# Altium project Minion_1_SiC780A_Rev01.PrjPCB (part 1 of 3)
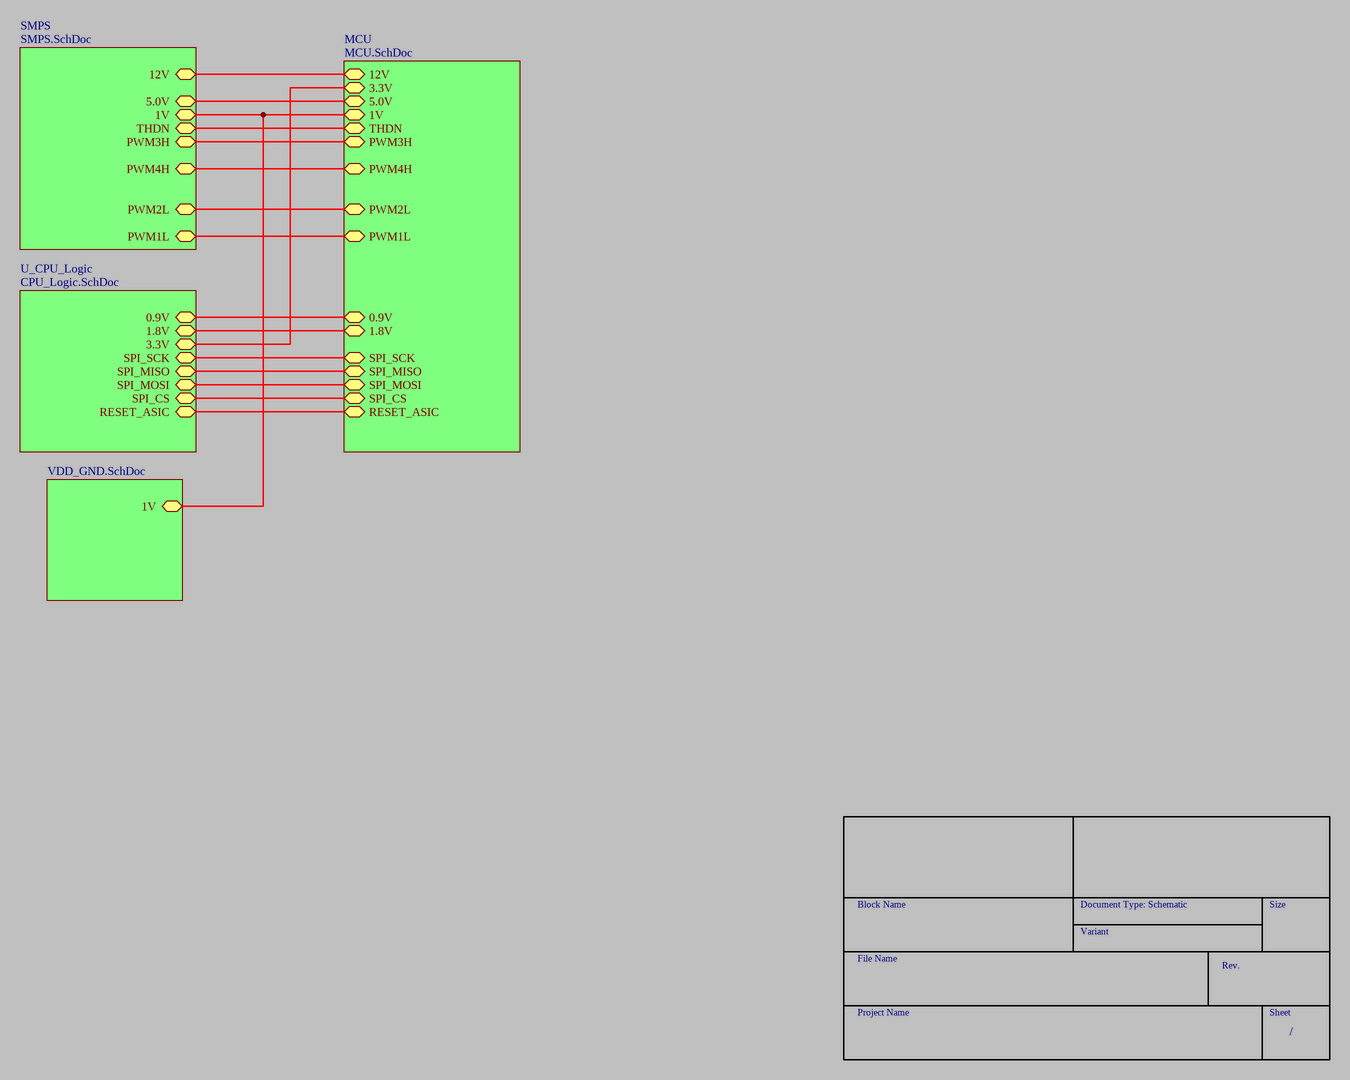
[diagram p0: Block.SchDoc]
5 sheets, 410 parts. Net scope: hierarchical (ports join the sheet entries above them; power ports are global).
Board file: Minion_1_SiC780A_Rev01.PcbDoc
Sheets:
  Block.SchDoc
    U_CPU_Logic = CPU_Logic.SchDoc
    MCU = MCU.SchDoc
    SMPS = SMPS.SchDoc
    VDD_GND = VDD_GND.SchDoc

## Sheet Block.SchDoc: Title
size A3; Date: Date; CompanyName: Integrated Micro-Electronics Bulgaria; Organization: Design & Development Department; Address1: Drawing Type; Address2: Address 1; Address3: Address 2; Address4: Address 3; DocumentNumber: 730xxx; Revision: 01; SheetNumber: 1; SheetTotal: 1; PageSetup: Record=PageOptions|CenterHorizontal=True|CenterVertical=True|PrintScale=0.70|XCorrection=1.00|YCorrection=1.00|PrintKind=2|BorderSize=5000000|LeftOffset=0|BottomOffset=0|Orientation=2|PaperLength=1000|PaperWidth=1000|Scale=100|PaperSource=7|PrintQuality=-4|MediaType=1|DitherType=10|PaperKind=11" x 17"|PrintScaleMode=1; SheetSize: A3; Time: Time; ModifiedDate: Mod. Date

### Sub-sheets
MCU = MCU.SchDoc: 1V, 12V, 3.3V, 5.0V, PWM3H, PWM4H, PWM2L, PWM1L, 1.8V, 0.9V, RESET_ASIC, SPI_CS, SPI_SCK, SPI_MISO, SPI_MOSI, THDN
SMPS = SMPS.SchDoc: 1V, 12V, 5.0V, PWM3H, PWM4H, PWM2L, PWM1L, THDN
U_CPU_Logic = CPU_Logic.SchDoc: 1.8V, 0.9V, SPI_SCK, SPI_CS, SPI_MOSI, SPI_MISO, RESET_ASIC, 3.3V
VDD_GND = VDD_GND.SchDoc: 1V

### Nets
0.9V: sheet U_CPU_Logic/0.9V, sheet MCU/0.9V
1.8V: sheet U_CPU_Logic/1.8V, sheet MCU/1.8V
1V: sheet MCU/1V, sheet SMPS/1V, sheet VDD_GND/1V
3.3V: sheet U_CPU_Logic/3.3V, sheet MCU/3.3V
5.0V: sheet MCU/5.0V, sheet SMPS/5.0V
12V: sheet MCU/12V, sheet SMPS/12V
PWM1L: sheet MCU/PWM1L, sheet SMPS/PWM1L
PWM2L: sheet MCU/PWM2L, sheet SMPS/PWM2L
PWM3H: sheet MCU/PWM3H, sheet SMPS/PWM3H
PWM4H: sheet MCU/PWM4H, sheet SMPS/PWM4H
RESET_ASIC: sheet U_CPU_Logic/RESET_ASIC, sheet MCU/RESET_ASIC
SPI_CS: sheet U_CPU_Logic/SPI_CS, sheet MCU/SPI_CS
SPI_MISO: sheet U_CPU_Logic/SPI_MISO, sheet MCU/SPI_MISO
SPI_MOSI: sheet U_CPU_Logic/SPI_MOSI, sheet MCU/SPI_MOSI
SPI_SCK: sheet U_CPU_Logic/SPI_SCK, sheet MCU/SPI_SCK
THDN: sheet MCU/THDN, sheet SMPS/THDN

### Notes on the sheet
- Block Name
- Document Type: Schematic
- Size
- File Name
- Variant
- Rev.
- Project Name
- Sheet
- /

## Sheet CPU_Logic.SchDoc: Title
size A1; Date: Date; CompanyName: Integrated Micro-Electronics Bulgaria; Organization: Design & Development Department; Address1: Drawing Type; Address2: Address 1; Address3: Address 2; Address4: Address 3; DocumentNumber: 730xxx; Revision: 01; SheetNumber: 1; SheetTotal: 1; PageSetup: Record=PageOptions|CenterHorizontal=True|CenterVertical=True|PrintScale=0.70|XCorrection=1.00|YCorrection=1.00|PrintKind=2|BorderSize=5000000|LeftOffset=0|BottomOffset=0|Orientation=2|PaperLength=1000|PaperWidth=1000|Scale=100|PaperSource=7|PrintQuality=-4|MediaType=1|DitherType=10|PaperKind=A4|PrintScaleMode=1; SheetSize: A3; Time: Time; ModifiedDate: Mod. Date
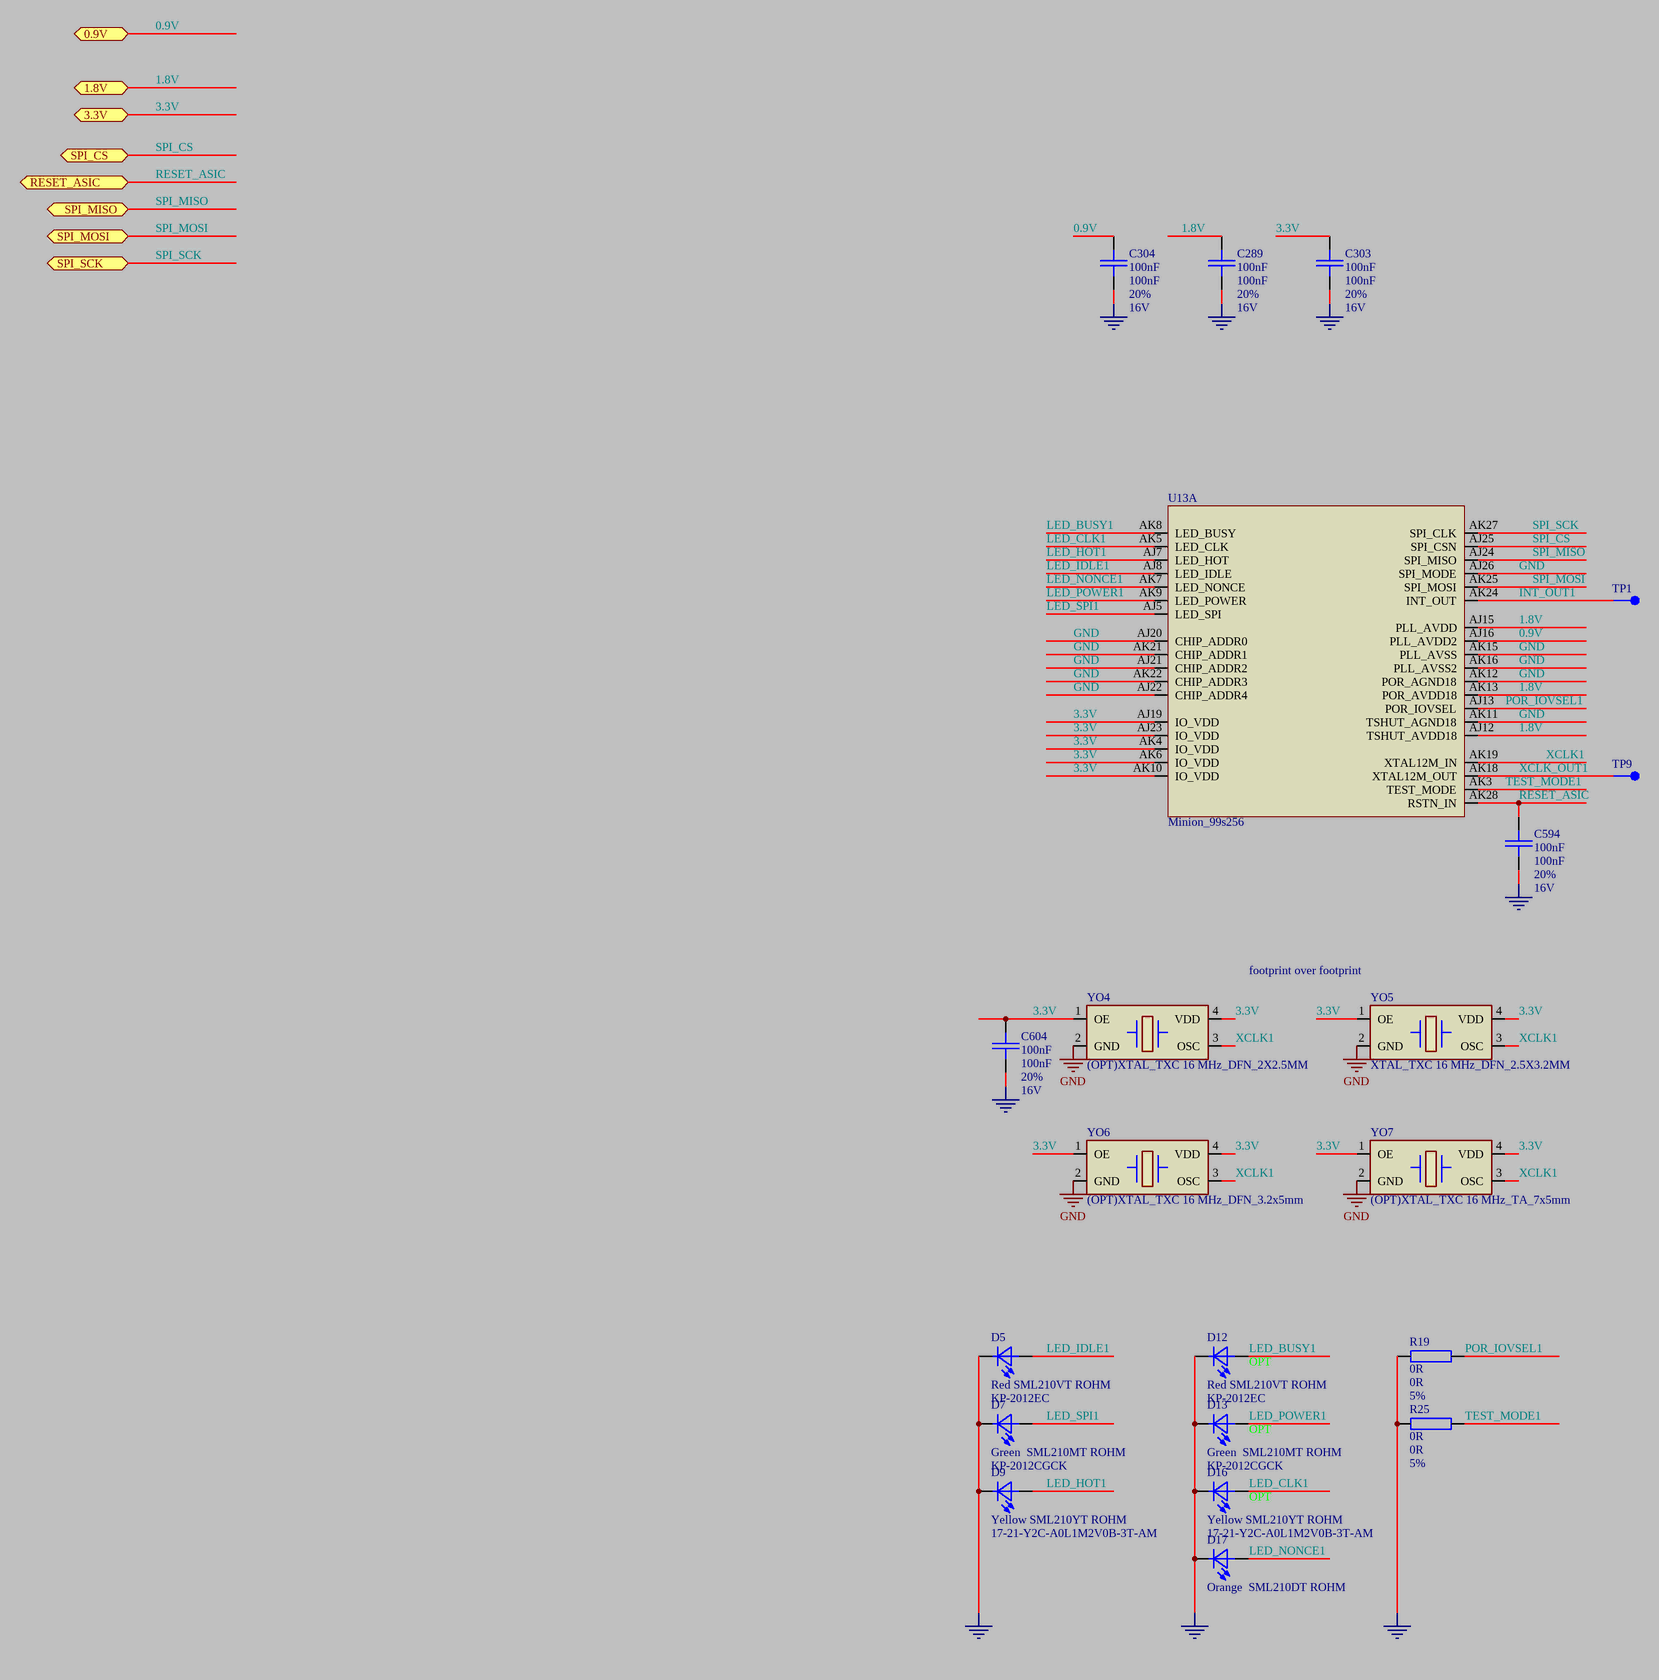
[diagram p1: CPU_Logic.SchDoc]

### Parts
C289  100nF  DB_TOLERANCE: 20%  DB_VOLTAGE: 16V  [SMD_0603_CAPC1608X95N]
C303  100nF  DB_TOLERANCE: 20%  DB_VOLTAGE: 16V  [SMD_0603_CAPC1608X95N]
C304  100nF  DB_TOLERANCE: 20%  DB_VOLTAGE: 16V  [SMD_0603_CAPC1608X95N]
C594  100nF  DB_TOLERANCE: 20%  DB_VOLTAGE: 16V  [SMD_0603_CAPC1608X95N]
C604  100nF  DB_TOLERANCE: 20%  DB_VOLTAGE: 16V  [SMD_0603_CAPC1608X95N]
D5  Red SML210VT ROHM  DB_VALUE: KP-2012EC  [SMD_0805_LED2012X100N]
D7  Green  SML210MT ROHM  DB_VALUE: KP-2012CGCK  [SMD_0805_LED2012X100N]
D9  Yellow SML210YT ROHM  DB_VALUE: 17-21-Y2C-A0L1M2V0B-3T-AM  [SMD_0805_LED2012X100N]
D12  Red SML210VT ROHM  DB_VALUE: KP-2012EC  [SMD_0805_LED2012X100N]
D13  Green  SML210MT ROHM  DB_VALUE: KP-2012CGCK  [SMD_0805_LED2012X100N]
D16  Yellow SML210YT ROHM  DB_VALUE: 17-21-Y2C-A0L1M2V0B-3T-AM  [SMD_0805_LED2012X100N]
D17  Orange  SML210DT ROHM  [SMD_0805_LED2012X100N]
R19  0R  DB_TOLERANCE: 5%  [SMD_0603_RESC1608X55N]
R25  0R  DB_TOLERANCE: 5%  [SMD_0603_RESC1608X55N]
TP1  TEST_POINT_1  [SMD_TP_100-254]  (value not drawn)
TP9  TEST_POINT_1  [SMD_TP_100-254]  (value not drawn)
U13  Minion_99s256  [SMD_BGA900C80P30X30]  (part A of 3)
YO4  (OPT)XTAL_TXC 16 MHz_DFN_2X2.5MM  [SMD_OSCCF200X250X90-4N]
YO5  XTAL_TXC 16 MHz_DFN_2.5X3.2MM  [SMD_OSCCF250X320X90-4N]
YO6  (OPT)XTAL_TXC 16 MHz_DFN_3.2x5mm  [SMD_OSCCF320X400X90-4N]
YO7  (OPT)XTAL_TXC 16 MHz_TA_7x5mm  [SMD_OSCCC500X700X100-4N]

### Ports
0.9V, 1.8V, 3.3V, RESET_ASIC, SPI_CS, SPI_MISO, SPI_MOSI, SPI_SCK

### Nets
GND: C289.1 C303.1 C304.1 C594.2 C604.2 D5.1(C) D7.1(C) D9.1(C) D12.1(C) D13.1(C) D16.1(C) D17.1(C) R19.1 R25.1 U13.AJ20(CHIP_ADDR0) U13.AJ21(CHIP_ADDR2) U13.AJ22(CHIP_ADDR4) U13.AJ26(SPI_MODE) U13.AK11(TSHUT_AGND18) U13.AK12(POR_AGND18) U13.AK15(PLL_AVSS) U13.AK16(PLL_AVSS2) U13.AK21(CHIP_ADDR1) U13.AK22(CHIP_ADDR3) YO4.2(GND) YO5.2(GND) YO6.2(GND) YO7.2(GND)
0.9V: C304.2 U13.AJ16(PLL_AVDD2) ; port 0.9V
1.8V: C289.2 U13.AJ12(TSHUT_AVDD18) U13.AJ15(PLL_AVDD) U13.AK13(POR_AVDD18) ; port 1.8V
3.3V: C303.2 C604.1 U13.AJ19(IO_VDD) U13.AJ23(IO_VDD) U13.AK4(IO_VDD) U13.AK6(IO_VDD) U13.AK10(IO_VDD) YO4.1(OE) YO4.4(VDD) YO5.1(OE) YO5.4(VDD) YO6.1(OE) YO6.4(VDD) YO7.1(OE) YO7.4(VDD) ; port 3.3V
INT_OUT1: TP1.1 U13.AK24(INT_OUT)
LED_BUSY1: D12.2(A) U13.AK8(LED_BUSY)
LED_CLK1: D16.2(A) U13.AK5(LED_CLK)
LED_HOT1: D9.2(A) U13.AJ7(LED_HOT)
LED_IDLE1: D5.2(A) U13.AJ8(LED_IDLE)
LED_NONCE1: D17.2(A) U13.AK7(LED_NONCE)
LED_POWER1: D13.2(A) U13.AK9(LED_POWER)
LED_SPI1: D7.2(A) U13.AJ5(LED_SPI)
POR_IOVSEL1: R19.2 U13.AJ13(POR_IOVSEL)
RESET_ASIC: C594.1 U13.AK28(RSTN_IN) ; port RESET_ASIC
SPI_CS: U13.AJ25(SPI_CSN) ; port SPI_CS
SPI_MISO: U13.AJ24(SPI_MISO) ; port SPI_MISO
SPI_MOSI: U13.AK25(SPI_MOSI) ; port SPI_MOSI
SPI_SCK: U13.AK27(SPI_CLK) ; port SPI_SCK
TEST_MODE1: R25.2 U13.AK3(TEST_MODE)
XCLK1: U13.AK19(XTAL12M_IN) YO4.3(OSC) YO5.3(OSC) YO6.3(OSC) YO7.3(OSC)
XCLK_OUT1: TP9.1 U13.AK18(XTAL12M_OUT)

### Notes on the sheet
- footprint over footprint
- (near D12) OPT
- (near D13) OPT
- (near D16) OPT

### Library data of the parts
C289 C303 C304 C594 C604 = CAP000027236: DB_PART_TYPE: Ceramic_SMD\Standard_X7R; DB_MANUFACTURER_PART: KEMET    C0603C104M4RAC; NOTE: <NOTE>; DB_T_RANGE: -55 to 125; DB_PACKAGE: 0603; DB_DESCRIPTION: C X7R 100nF 20% 16V 0603; DB_CERTIFIED: ISHIDDEN=T; DB_APPROVED_ON: 09.10.2010 г.; DB_STATUS: NEW; DB_PART_NUMBER: CAP000027236; DB_VALUE: 100nF; DB_PCB_DEVICE: SMD_0603_CAPC1608X95N; DB_PRICE: ISHIDDEN=T; DB_LEADTIME: ISHIDDEN=T; DB_MOQ: ISHIDDEN=T; DB_PRICE_DATE: ISHIDDEN=T; DB_APPROVED_BY: ISHIDDEN=T; DB_DATASHEET: http://john.epiqdesign.com/projects/CIS_Datasheets/F3102_CE_Kemet.pdf?rev=92&sc=0
D5 D12 = OPT000000095: DB_MANUFACTURER_PART: KINGBRIGHT       KP-2012EC; NOTE: <NOTE>; DB_T_RANGE: -40 to 85; DB_PACKAGE: 0805; DB_DESCRIPTION: LED RED 0805; DB_CERTIFIED: ISHIDDEN=T; DB_APPROVED_BY: VSN; DB_APPROVED_ON: 08.4.2014 г. 09:20:29; DB_STATUS: NEW; DB_PCB_DEVICE: SMD_0805_LED2012X100N; DB_PART_NUMBER: OPT000000095; DB_PART_TYPE: LED; DB_COLOUR: RED; DB_DATASHEET: http://john.epiqdesign.com/projects/CIS_Datasheets/LED_KP-2012EC_0805_RED.pdf?rev=1358&sc=0
D7 D13 = OPT000000096: DB_MANUFACTURER_PART: KINGBRIGHT       KP-2012CGCK; NOTE: <NOTE>; DB_T_RANGE: -40 to 85; DB_PACKAGE: 0805; DB_DESCRIPTION: LED GREEN 0805; DB_CERTIFIED: ISHIDDEN=T; DB_APPROVED_BY: VSN; DB_APPROVED_ON: 08.4.2014 г. 09:22:12; DB_STATUS: NEW; DB_PCB_DEVICE: SMD_0805_LED2012X100N; DB_PART_NUMBER: OPT000000096; DB_PART_TYPE: LED; DB_COLOUR: GREEN; DB_DATASHEET: http://john.epiqdesign.com/projects/CIS_Datasheets/LED_KP-2012CGCK_0805_GREEN.pdf?rev=1359&sc=0
D9 D16 = OPT000000092: DB_MANUFACTURER_PART: EVERLIGHT       17-21-Y2C-A0L1M2V0B-3T-AM; NOTE: <NOTE>; DB_T_RANGE: -40 to 100; DB_PACKAGE: 0805; DB_DESCRIPTION: LED YELLOW 0805; DB_CERTIFIED: AUT; DB_APPROVED_BY: VSN; DB_APPROVED_ON: 17.6.2013 г. 13:21:58; DB_STATUS: NEW; DB_PCB_DEVICE: SMD_0805_LED2012X100N; DB_PART_NUMBER: OPT000000092; DB_PART_TYPE: LED; DB_COLOUR: YELLOW; DB_DATASHEET: http://john.epiqdesign.com/projects/CIS_Datasheets/LED_17-21-Y2C-A0L1M2V0B-3T-AM.pdf?rev=1220&sc=0
D17 = OPT000000096: DB_PART_TYPE: LED; DB_MANUFACTURER_PART: KINGBRIGHT       KP-2012CGCK; NOTE: <NOTE>; DB_T_RANGE: -40 to 85; DB_COLOUR: GREEN; DB_PACKAGE: 0805; DB_DESCRIPTION: LED GREEN 0805; DB_CERTIFIED: ISHIDDEN=T; DB_APPROVED_BY: VSN; DB_APPROVED_ON: 08.4.2014 г. 09:22:12; DB_STATUS: NEW; DB_VALUE: KP-2012CGCK; DB_PCB_DEVICE: SMD_0805_LED2012X100N; DB_PART_NUMBER: OPT000000096; DB_DATASHEET: http://john.epiqdesign.com/projects/CIS_Datasheets/LED_KP-2012CGCK_0805_GREEN.pdf?rev=1359&sc=0
R19 R25 = RES000006349: DB_PART_TYPE: SMD; DB_MANUFACTURER_PART: YAGEO    RC0603JR-070R; NOTE: <NOTE>; DB_T_RANGE: -55 to 155; DB_POWER: 1/10W; DB_PACKAGE: 0603; DB_DESCRIPTION: R SMD 0R 5% 1/10W 0603; DB_CERTIFIED: ISHIDDEN=T; DB_PRICE: 0.000364; DB_MOQ: 5000; DB_APPROVED_ON: 09.10.2010 г.; DB_STATUS: NEW; R_BDS: R; DB_PART_NUMBER: RES000006349; DB_VALUE: 0R; DB_PCB_DEVICE: SMD_0603_RESC1608X55N; DB_PRICE_DATE: 2010-12-23; DB_APPROVED_BY: ISHIDDEN=T; DB_DATASHEET: http://john.epiqdesign.com/projects/CIS_Datasheets/PYu-RC0603_51_RoHS_L_4_YAGEO.pdf?rev=138&sc=0
TP1 TP9 = TPO000000001: DB_PART_TYPE: Test Point; DB_VALUE: 100_254; DB_PACKAGE: ISHIDDEN=T; DB_DESCRIPTION: Test Point 100_254; DB_APPROVED_ON: 10.9.2010 г.; DB_STATUS: NEW; DB_PART_NUMBER: TPO000000001; DB_DIAMETER: 100_254; DB_PCB_DEVICE: SMD_TP_100-254; DB_MANUFACTURER_PART: ISHIDDEN=T; DB_CERTIFIED: ISHIDDEN=T; DB_PRICE: ISHIDDEN=T; DB_LEADTIME: ISHIDDEN=T; DB_MOQ: ISHIDDEN=T; DB_PRICE_DATE: ISHIDDEN=T; DB_APPROVED_BY: ISHIDDEN=T; DB_DATASHEET: ISHIDDEN=T
YO4 = SMD_OSC_DFN_2X2.5MM: NOTE: <NOTE>; DB_PCB_DEVICE: SMD_OSCCF200X250X90-4N
YO5 = SMD_OSC_DFN_2.5X3.2MM: NOTE: <NOTE>; DB_PCB_DEVICE: SMD_OSCCF250X320X90-4N
YO6 = SMD_OSC_DFN_3.2x5mm: NOTE: <NOTE>; DB_PCB_DEVICE: SMD_OSCCF320X400X90-4N
YO7 = SMD_OSC_TA_7x5mm: NOTE: <NOTE>; DB_PCB_DEVICE: SMD_OSCCC500X700X100-4N
U13 = Minion_99s256: DB_PCB_DEVICE: SMD_BGA900C80P30X30

## Sheet MCU.SchDoc: Title
size A2; Date: Date; CompanyName: Integrated Micro-Electronics Bulgaria; Organization: Design & Development Department; Address1: Drawing Type; Address2: Address 1; Address3: Address 2; Address4: Address 3; DocumentNumber: 730xxx; Revision: 01; SheetNumber: 1; SheetTotal: 1; PageSetup: Record=PageOptions|CenterHorizontal=True|CenterVertical=True|PrintScale=0.70|XCorrection=1.00|YCorrection=1.00|PrintKind=2|BorderSize=5000000|LeftOffset=0|BottomOffset=0|Orientation=2|PaperLength=1000|PaperWidth=1000|Scale=100|PaperSource=7|PrintQuality=-4|MediaType=1|DitherType=10|PaperKind=A4|PrintScaleMode=1; SheetSize: A3; Time: Time; ModifiedDate: Mod. Date
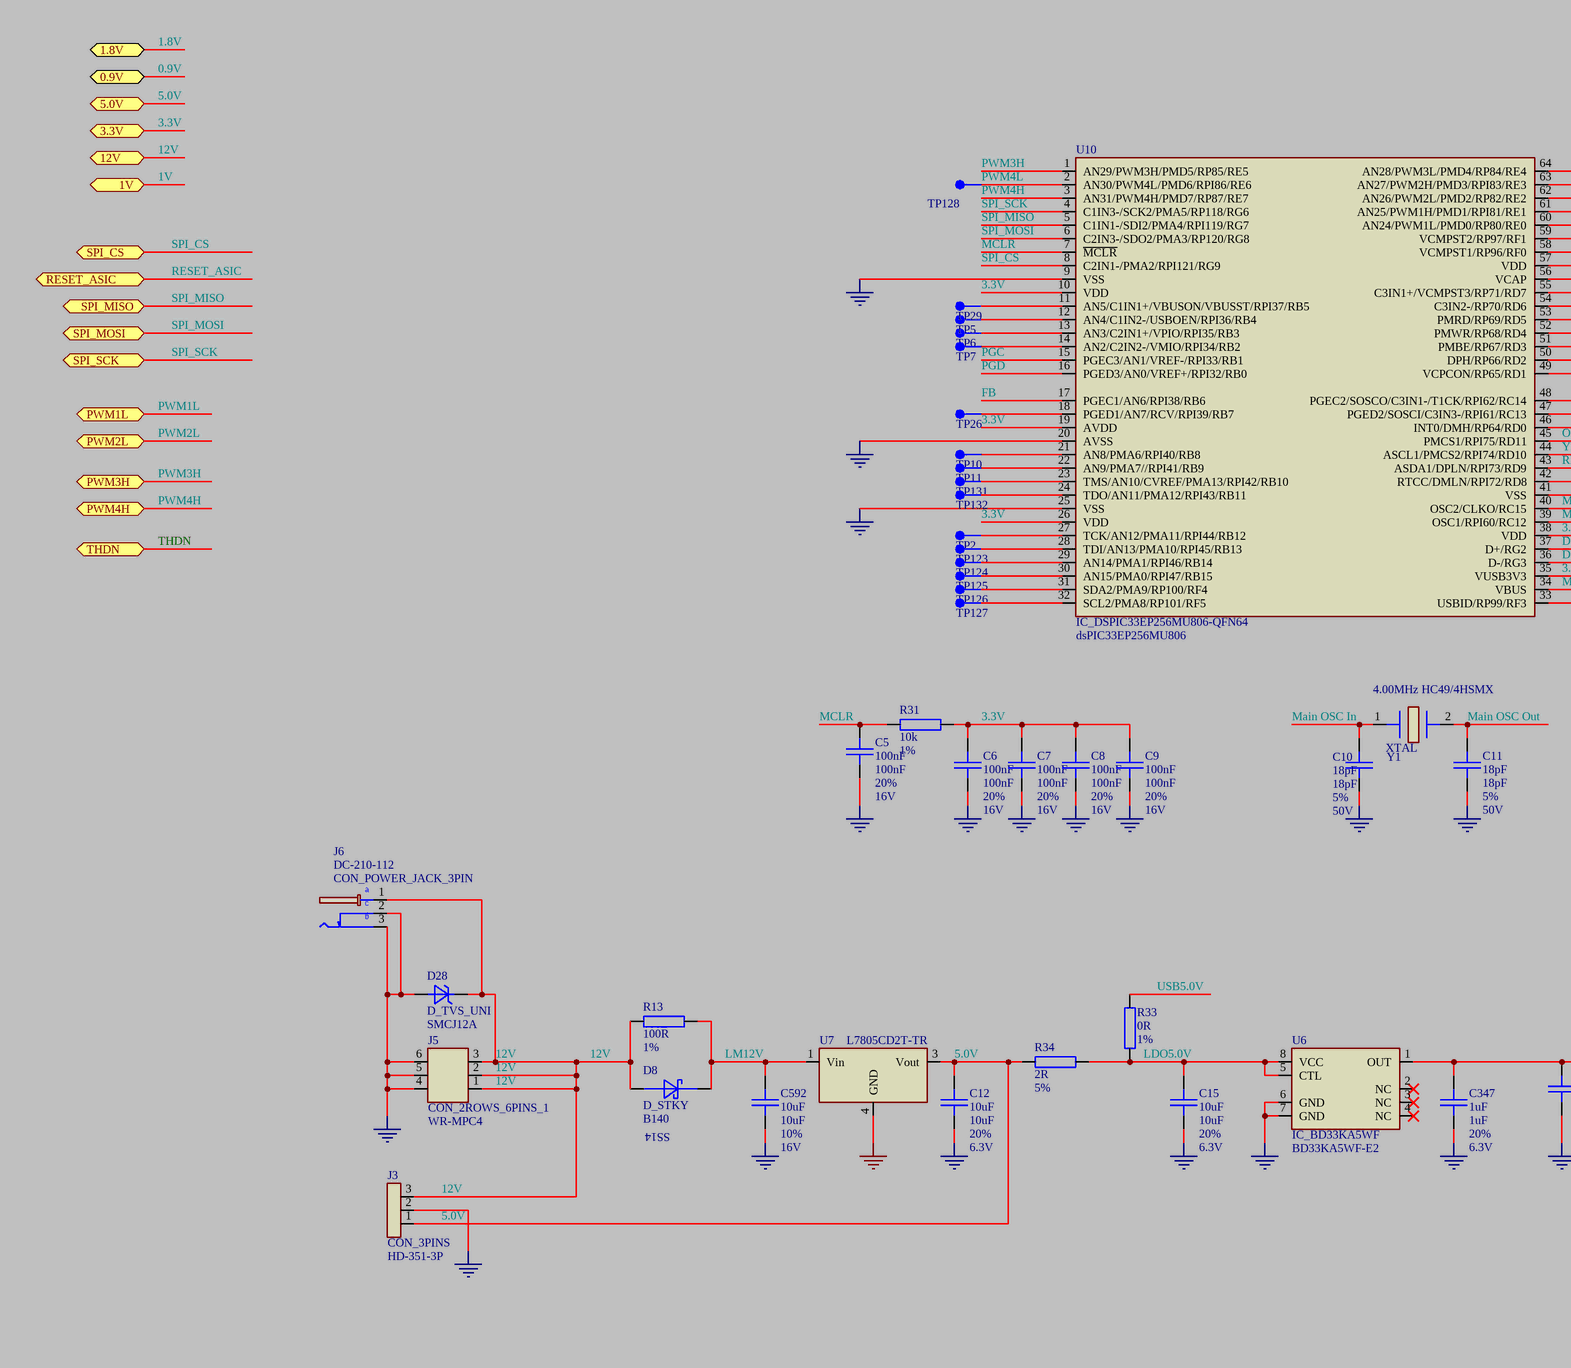
[diagram p2: MCU.SchDoc, left]
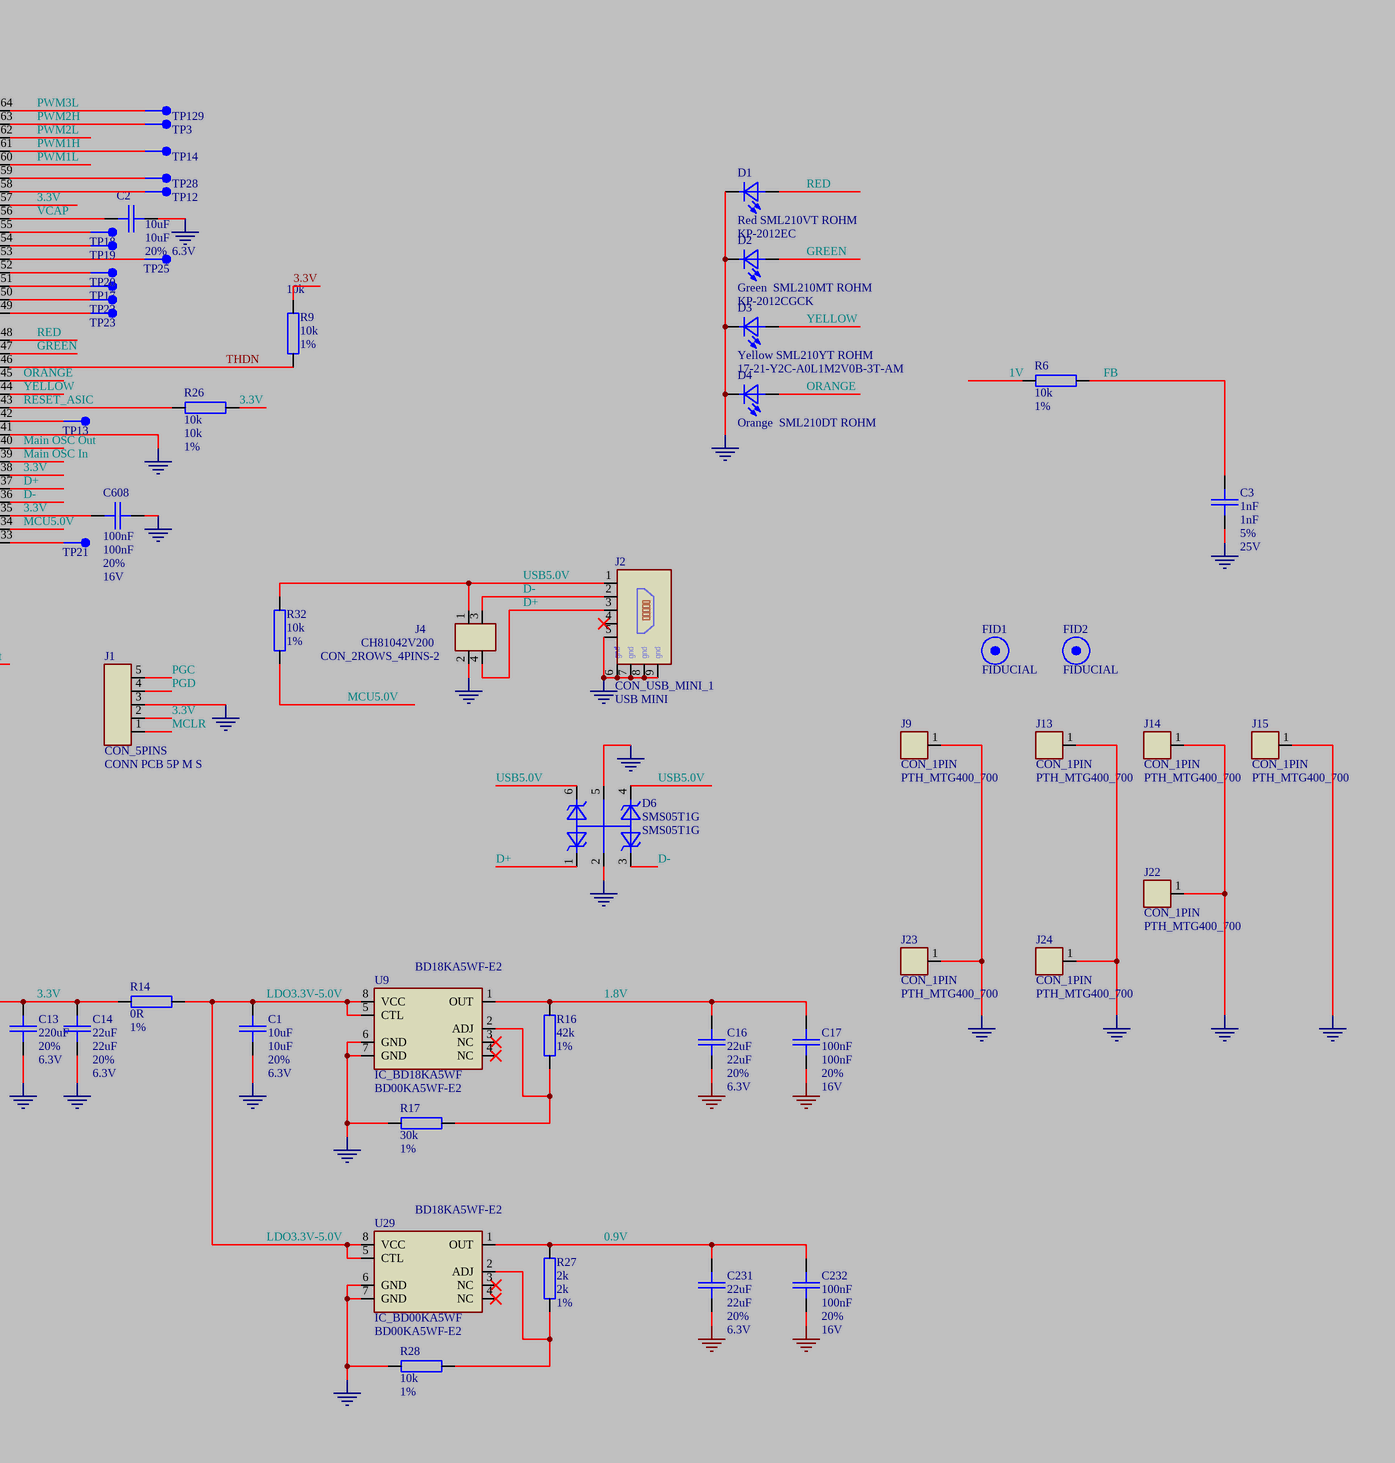
[diagram p3: MCU.SchDoc, right]

### Parts
C1  10uF  DB_TOLERANCE: 20%  DB_VOLTAGE: 6.3V  [SMD_0603_CAPC1608X95N]
C2  10uF  DB_TOLERANCE: 20%  DB_VOLTAGE: 6.3V  [SMD_0603_CAPC1608X95N]
C3  1nF  DB_TOLERANCE: 5%  DB_VOLTAGE: 25V  [SMD_0603_CAPC1608X95N]
C5  100nF  DB_TOLERANCE: 20%  DB_VOLTAGE: 16V  [SMD_0603_CAPC1608X95N]
C6  100nF  DB_TOLERANCE: 20%  DB_VOLTAGE: 16V  [SMD_0603_CAPC1608X95N]
C7  100nF  DB_TOLERANCE: 20%  DB_VOLTAGE: 16V  [SMD_0603_CAPC1608X95N]
C8  100nF  DB_TOLERANCE: 20%  DB_VOLTAGE: 16V  [SMD_0603_CAPC1608X95N]
C9  100nF  DB_TOLERANCE: 20%  DB_VOLTAGE: 16V  [SMD_0603_CAPC1608X95N]
C10  18pF  DB_TOLERANCE: 5%  DB_VOLTAGE: 50V  [SMD_0603_CAPC1608X95N]
C11  18pF  DB_TOLERANCE: 5%  DB_VOLTAGE: 50V  [SMD_0603_CAPC1608X95N]
C12  10uF  DB_TOLERANCE: 20%  DB_VOLTAGE: 6.3V  [SMD_0603_CAPC1608X95N]
C13  DB_TOLERANCE: 20%  DB_VOLTAGE: 6.3V  [SMD_1210_CAPC3225X279N]  (hidden comment: 220uF)
C14  22uF  DB_TOLERANCE: 20%  DB_VOLTAGE: 6.3V  [SMD_0805_CAPC2012X145N]
C15  10uF  DB_TOLERANCE: 20%  DB_VOLTAGE: 6.3V  [SMD_0603_CAPC1608X95N]
C16  22uF  DB_TOLERANCE: 20%  DB_VOLTAGE: 6.3V  [SMD_0805_CAPC2012X145N]
C17  100nF  DB_TOLERANCE: 20%  DB_VOLTAGE: 16V  [SMD_0603_CAPC1608X95N]
C231  22uF  DB_TOLERANCE: 20%  DB_VOLTAGE: 6.3V  [SMD_0805_CAPC2012X145N]
C232  100nF  DB_TOLERANCE: 20%  DB_VOLTAGE: 16V  [SMD_0603_CAPC1608X95N]
C347  1uF  DB_TOLERANCE: 20%  DB_VOLTAGE: 6.3V  [SMD_0603_CAPC1608X95N]
C592  10uF  DB_TOLERANCE: 10%  DB_VOLTAGE: 16V  [SMD_0805_CAPC2012X145N]
C608  100nF  DB_TOLERANCE: 20%  DB_VOLTAGE: 16V  [SMD_0603_CAPC1608X95N]
D1  Red SML210VT ROHM  DB_VALUE: KP-2012EC  [SMD_0805_LED2012X100N]
D2  Green  SML210MT ROHM  DB_VALUE: KP-2012CGCK  [SMD_0805_LED2012X100N]
D3  Yellow SML210YT ROHM  DB_VALUE: 17-21-Y2C-A0L1M2V0B-3T-AM  [SMD_0805_LED2012X100N]
D4  Orange  SML210DT ROHM  [SMD_0805_LED2012X100N]
D6  SMS05T1G  [SMD_SOT457_SOT95P275X110-6N]
D8  D_STKY  DB_VALUE: B140  [SMD_DO214AC_SMA]
D28  D_TVS_UNI  DB_VALUE: SMCJ12A  [SMD_DO214AC_SMC]
FID1  FIDUCIAL  [FID100X200]
FID2  FIDUCIAL  [FID100X200]
J1  CON_5PINS  DB_VALUE: CONN PCB 5P M S  [PTH_HDRV05W64P254_1X05]
J2  CON_USB_MINI_1  DB_VALUE: USB MINI  [SMD_CON-CVILUX-CU04-SCM15B0]
J3  CON_3PINS  DB_VALUE: HD-351-3P  [PTH_CON_HD-351-3P]
J4  CON_2ROWS_4PINS-2  DB_VALUE: CH81042V200  [PTH_HDRV40W6240P254_2X02_M]
J5  CON_2ROWS_6PINS_1  DB_VALUE: WR-MPC4  [PTH_CON_WR-MRC4-6P]
J6  CON_POWER_JACK_3PIN  DB_VALUE: DC-210-112  [PTH_DC-POWER-JACK_210-112]
J9  CON_1PIN  [PTH_MTG400_700]
J13  CON_1PIN  [PTH_MTG400_700]
J14  CON_1PIN  [PTH_MTG400_700]
J15  CON_1PIN  [PTH_MTG400_700]
J22  CON_1PIN  [PTH_MTG400_700]
J23  CON_1PIN  [PTH_MTG400_700]
J24  CON_1PIN  [PTH_MTG400_700]
R6  DB_TOLERANCE: 1%  [SMD_0603_RESC1608X55N]  (hidden comment: 10k)
R9  10k  DB_TOLERANCE: 1%  [SMD_0603_RESC1608X55N]
R13  DB_TOLERANCE: 1%  [SMD_1206_RESC3216X65N]  (hidden comment: 100R)
R14  DB_TOLERANCE: 1%  [SMD_1206_RESC3216X65N]  (hidden comment: 0R)
R16  DB_VALUE: 42k  DB_TOLERANCE: 1%  [SMD_0603_RESC1608X55N]  (hidden comment: R_42k)
R17  DB_TOLERANCE: 1%  [SMD_0603_RESC1608X55N]  (hidden comment: 30k)
R26  10k  DB_TOLERANCE: 1%  [SMD_0603_RESC1608X55N]
R27  2k  DB_TOLERANCE: 1%  [SMD_0603_RESC1608X55N]
R28  DB_TOLERANCE: 1%  [SMD_0603_RESC1608X55N]  (hidden comment: 10k)
R31  DB_TOLERANCE: 1%  [SMD_0603_RESC1608X55N]  (hidden comment: 10k)
R32  DB_TOLERANCE: 1%  [SMD_0603_RESC1608X55N]  (hidden comment: 10k)
R33  DB_TOLERANCE: 1%  [SMD_0603_RESC1608X55N]  (hidden comment: 0R)
R34  DB_TOLERANCE: 5%  [SMD_1206_RESC3216X65N]  (hidden comment: 2R)
TP2  TEST_POINT_1  [SMD_TP_100-254]  (value not drawn)
TP3  TEST_POINT_1  [SMD_TP_100-254]  (value not drawn)
TP5  TEST_POINT_1  [SMD_TP_100-254]  (value not drawn)
TP6  TEST_POINT_1  [SMD_TP_100-254]  (value not drawn)
TP7  TEST_POINT_1  [SMD_TP_100-254]  (value not drawn)
TP10  TEST_POINT_1  [SMD_TP_100-254]  (value not drawn)
TP11  TEST_POINT_1  [SMD_TP_100-254]  (value not drawn)
TP12  TEST_POINT_1  [SMD_TP_100-254]  (value not drawn)
TP13  TEST_POINT_1  [SMD_TP_100-254]  (value not drawn)
TP14  TEST_POINT_1  [SMD_TP_100-254]  (value not drawn)
TP17  TEST_POINT_1  [SMD_TP_100-254]  (value not drawn)
TP18  TEST_POINT_1  [SMD_TP_100-254]  (value not drawn)
TP19  TEST_POINT_1  [SMD_TP_100-254]  (value not drawn)
TP20  TEST_POINT_1  [SMD_TP_100-254]  (value not drawn)
TP21  TEST_POINT_1  [SMD_TP_100-254]  (value not drawn)
TP22  TEST_POINT_1  [SMD_TP_100-254]  (value not drawn)
TP23  TEST_POINT_1  [SMD_TP_100-254]  (value not drawn)
TP25  TEST_POINT_1  [SMD_TP_100-254]  (value not drawn)
TP26  TEST_POINT_1  [SMD_TP_100-254]  (value not drawn)
TP28  TEST_POINT_1  [SMD_TP_100-254]  (value not drawn)
TP29  TEST_POINT_1  [SMD_TP_100-254]  (value not drawn)
TP123  TEST_POINT_1  [SMD_TP_100-254]  (value not drawn)
TP124  TEST_POINT_1  [SMD_TP_100-254]  (value not drawn)
TP125  TEST_POINT_1  [SMD_TP_100-254]  (value not drawn)
TP126  TEST_POINT_1  [SMD_TP_100-254]  (value not drawn)
TP127  TEST_POINT_1  [SMD_TP_100-254]  (value not drawn)
TP128  TEST_POINT_1  [SMD_TP_100-254]  (value not drawn)
TP129  TEST_POINT_1  [SMD_TP_100-254]  (value not drawn)
TP131  TEST_POINT_1  [SMD_TP_100-254]  (value not drawn)
TP132  TEST_POINT_1  [SMD_TP_100-254]  (value not drawn)
U6  IC_BD33KA5WF  DB_VALUE: BD33KA5WF-E2  [SMD_SOIC127P620X160-8N]
U7  L7805CD2T-TR  [SMD_TO254P1542X460-3_4N]
U9  IC_BD18KA5WF  DB_VALUE: BD00KA5WF-E2  [SMD_SOIC127P620X160-8N]
U10  IC_DSPIC33EP256MU806-QFN64  DB_VALUE: dsPIC33EP256MU806  [SMD_QFP50P1200X1200X120-64N]
U29  IC_BD00KA5WF  DB_VALUE: BD00KA5WF-E2  [SMD_SOIC127P620X160-8N]
Y1  XTAL  DB_VALUE: 4.00MHz HC49/4HSMX  [SMD_HC49_XTAL1140X480X420N]

### Ports
0.9V, 1.8V, 1V, 3.3V, 5.0V, 12V, PWM1L, PWM2L, PWM3H, PWM4H, RESET_ASIC, SPI_CS, SPI_MISO, SPI_MOSI, SPI_SCK, THDN

### Nets
GND: C1.2 C2.2 C3.2 C5.2 C6.2 C7.2 C8.2 C9.2 C10.2 C11.2 C12.2 C13.1 C14.2 C15.2 C16.2 C17.2 C231.2 C232.2 C347.2 C592.2 C608.2 D1.1(C) D2.1(C) D3.1(C) D4.1(C) D6.2 D6.5 D28.2(A) J1.3 J2.5 J2.6 J2.7 J2.8 J2.9 J3.2 J4.2 J5.4 J5.5 J5.6 J6.2 J6.3 J9.1 J13.1 J14.1 J15.1 J22.1 J23.1 J24.1 R17.2 R28.2 U6.6(GND) U6.7(GND) U7.4(GND) U9.6(GND) U9.7(GND) U10.9(VSS) U10.20(AVSS) U10.25(VSS) U10.41(VSS) U29.6(GND) U29.7(GND)
0.9V: C231.1 C232.1 R27.1 U29.1(OUT) ; port 0.9V
1.8V: C16.1 C17.1 R16.1 U9.1(OUT) ; port 1.8V
1V: R6.2 ; port 1V
3.3V: C6.1 C7.1 C8.1 C9.1 C13.2 C14.1 C347.1 C608.1 J1.2 R9.2 R14.2 R26.1 R31.2 U6.1(OUT) U10.10(VDD) U10.19(AVDD) U10.26(VDD) U10.35(VUSB3V3) U10.38(VDD) U10.57(VDD) ; port 3.3V
5.0V: C12.1 J3.1 R34.2 U7.3(Vout) ; port 5.0V
12V: D8.2(A) D28.1(C) J3.3 J5.1 J5.2 J5.3 J6.1 R13.2 ; port 12V
D+: D6.1 J2.3 J4.4 U10.37(D+/RG2)
D-: D6.3 J2.2 J4.3 U10.36(D-/RG3)
FB: C3.1 R6.1 U10.17(PGEC1/AN6/RPI38/RB6)
GREEN: D2.2(A) U10.47(PGED2/SOSCI/C3IN3-/RPI61/RC13)
LDO3.3V-5.0V: C1.1 R14.1 U9.5(CTL) U9.8(VCC) U29.5(CTL) U29.8(VCC)
LDO5.0V: C15.1 R33.1 R34.1 U6.5(CTL) U6.8(VCC)
LM12V: C592.1 D8.1(C) R13.1 U7.1(Vin)
Main OSC In: C10.1 U10.39(OSC1/RPI60/RC12) Y1.1
Main OSC Out: C11.1 U10.40(OSC2/CLKO/RC15) Y1.2
MCLR: C5.1 J1.1 R31.1 U10.7(~{MCLR})
MCU5.0V: R32.2 U10.34(VBUS)
ORANGE: D4.2(A) U10.45(PMCS1/RPI75/RD11)
PGC: J1.5 U10.15(PGEC3/AN1/VREF-/RPI33/RB1)
PGD: J1.4 U10.16(PGED3/AN0/VREF+/RPI32/RB0)
PWM1H: TP14.1 U10.61(AN25/PWM1H/PMD1/RPI81/RE1)
PWM1L: U10.60(AN24/PWM1L/PMD0/RP80/RE0) ; port PWM1L
PWM2H: TP3.1 U10.63(AN27/PWM2H/PMD3/RPI83/RE3)
PWM2L: U10.62(AN26/PWM2L/PMD2/RP82/RE2) ; port PWM2L
PWM3H: U10.1(AN29/PWM3H/PMD5/RP85/RE5) ; port PWM3H
PWM3L: TP129.1 U10.64(AN28/PWM3L/PMD4/RP84/RE4)
PWM4H: U10.3(AN31/PWM4H/PMD7/RP87/RE7) ; port PWM4H
PWM4L: TP128.1 U10.2(AN30/PWM4L/PMD6/RPI86/RE6)
RED: D1.2(A) U10.48(PGEC2/SOSCO/C3IN1-/T1CK/RPI62/RC14)
RESET_ASIC: R26.2 U10.43(ASDA1/DPLN/RPI73/RD9) ; port RESET_ASIC
SPI_CS: U10.8(C2IN1-/PMA2/RPI121/RG9) ; port SPI_CS
SPI_MISO: U10.5(C1IN1-/SDI2/PMA4/RPI119/RG7) ; port SPI_MISO
SPI_MOSI: U10.6(C2IN3-/SDO2/PMA3/RP120/RG8) ; port SPI_MOSI
SPI_SCK: U10.4(C1IN3-/SCK2/PMA5/RP118/RG6) ; port SPI_SCK
THDN: R9.1 U10.46(INT0/DMH/RP64/RD0) ; port THDN
USB5.0V: D6.4 D6.6 J2.1 J4.1 R32.1 R33.2
VCAP: C2.1 U10.56(VCAP)
YELLOW: D3.2(A) U10.44(ASCL1/PMCS2/RPI74/RD10)
NetR16_2: R16.2 R17.1 U9.2(ADJ)
NetR27_2: R27.2 R28.1 U29.2(ADJ)
NetTP2_1: TP2.1 U10.27(TCK/AN12/PMA11/RPI44/RB12)
NetTP5_1: TP5.1 U10.12(AN4/C1IN2-/USBOEN/RPI36/RB4)
NetTP6_1: TP6.1 U10.13(AN3/C2IN1+/VPIO/RPI35/RB3)
NetTP7_1: TP7.1 U10.14(AN2/C2IN2-/VMIO/RPI34/RB2)
NetTP10_1: TP10.1 U10.21(AN8/PMA6/RPI40/RB8)
NetTP11_1: TP11.1 U10.22(AN9/PMA7//RPI41/RB9)
NetTP12_1: TP12.1 U10.58(VCMPST1/RP96/RF0)
NetTP13_1: TP13.1 U10.42(RTCC/DMLN/RPI72/RD8)
NetTP17_1: TP17.1 U10.51(PMBE/RP67/RD3)
NetTP18_1: TP18.1 U10.55(C3IN1+/VCMPST3/RP71/RD7)
NetTP19_1: TP19.1 U10.54(C3IN2-/RP70/RD6)
NetTP20_1: TP20.1 U10.52(PMWR/RP68/RD4)
NetTP21_1: TP21.1 U10.33(USBID/RP99/RF3)
NetTP22_1: TP22.1 U10.50(DPH/RP66/RD2)
NetTP23_1: TP23.1 U10.49(VCPCON/RP65/RD1)
NetTP25_1: TP25.1 U10.53(PMRD/RP69/RD5)
NetTP26_1: TP26.1 U10.18(PGED1/AN7/RCV/RPI39/RB7)
NetTP28_1: TP28.1 U10.59(VCMPST2/RP97/RF1)
NetTP29_1: TP29.1 U10.11(AN5/C1IN1+/VBUSON/VBUSST/RPI37/RB5)
NetTP123_1: TP123.1 U10.28(TDI/AN13/PMA10/RPI45/RB13)
NetTP124_1: TP124.1 U10.29(AN14/PMA1/RPI46/RB14)
NetTP125_1: TP125.1 U10.30(AN15/PMA0/RPI47/RB15)
NetTP126_1: TP126.1 U10.31(SDA2/PMA9/RP100/RF4)
NetTP127_1: TP127.1 U10.32(SCL2/PMA8/RP101/RF5)
NetTP131_1: TP131.1 U10.23(TMS/AN10/CVREF/PMA13/RPI42/RB10)
NetTP132_1: TP132.1 U10.24(TDO/AN11/PMA12/RPI43/RB11)

Not connected (* = marked no-connect by the designer): J2 4*; U6 2(NC)* 3(NC)* 4(NC)*; U9 3(NC)* 4(NC)*; U29 3(NC)* 4(NC)*

### Notes on the sheet
- (near U9) BD18KA5WF-E2
- (near D8) SS14
- (near U29) BD18KA5WF-E2
- (in symbol CON000000026) a; c; b
- (in symbol CON000000048) gnd

### Library data of the parts
C1 C2 C12 C15 = CAP000043646: DB_MANUFACTURER_PART: KEMET    C0603C106M9PAC; DB_PART_TYPE: Ceramic_SMD\Standard_X5R; NOTE: <NOTE>; DB_APPROVED_BY: ISHIDDEN=T; DB_APPROVED_ON: 09.10.2010 г.; DB_DESCRIPTION: C X5R 10uF 20% 6.3V 0603; DB_PACKAGE: 0603; DB_STATUS: NEW; DB_T_RANGE: -55 to 85; DB_PART_NUMBER: CAP000043646; DB_VALUE: 10uF; DB_CERTIFIED: ISHIDDEN=T; DB_DATASHEET: http://john.epiqdesign.com/projects/CIS_Datasheets/F3102_CE_Kemet.pdf?rev=92&sc=0; DB_LEADTIME: ISHIDDEN=T; DB_MOQ: ISHIDDEN=T; DB_PCB_DEVICE: SMD_0603_CAPC1608X95N; DB_PRICE: ISHIDDEN=T; DB_PRICE_DATE: ISHIDDEN=T
C3 = CAP000024113: DB_PART_TYPE: Ceramic_SMD\Standard_X7R; DB_MANUFACTURER_PART: KEMET    C0603C102J3RAC; NOTE: <NOTE>; DB_T_RANGE: -55 to 125; DB_PACKAGE: 0603; DB_DESCRIPTION: C X7R 1nF 5% 25V 0603; DB_CERTIFIED: ISHIDDEN=T; DB_APPROVED_ON: 09.10.2010 г.; DB_STATUS: NEW; DB_PART_NUMBER: CAP000024113; DB_VALUE: 1nF; DB_PCB_DEVICE: SMD_0603_CAPC1608X95N; DB_PRICE: ISHIDDEN=T; DB_LEADTIME: ISHIDDEN=T; DB_MOQ: ISHIDDEN=T; DB_PRICE_DATE: ISHIDDEN=T; DB_APPROVED_BY: ISHIDDEN=T; DB_DATASHEET: http://john.epiqdesign.com/projects/CIS_Datasheets/F3102_CE_Kemet.pdf?rev=92&sc=0
C5-C9 C17 C232 C608 = CAP000027236: DB_MANUFACTURER_PART: KEMET    C0603C104M4RAC; DB_PART_TYPE: Ceramic_SMD\Standard_X7R; NOTE: <NOTE>; DB_APPROVED_BY: ISHIDDEN=T; DB_APPROVED_ON: 09.10.2010 г.; DB_DESCRIPTION: C X7R 100nF 20% 16V 0603; DB_PACKAGE: 0603; DB_STATUS: NEW; DB_T_RANGE: -55 to 125; DB_PART_NUMBER: CAP000027236; DB_VALUE: 100nF; DB_CERTIFIED: ISHIDDEN=T; DB_DATASHEET: http://john.epiqdesign.com/projects/CIS_Datasheets/F3102_CE_Kemet.pdf?rev=92&sc=0; DB_LEADTIME: ISHIDDEN=T; DB_MOQ: ISHIDDEN=T; DB_PCB_DEVICE: SMD_0603_CAPC1608X95N; DB_PRICE: ISHIDDEN=T; DB_PRICE_DATE: ISHIDDEN=T
C10 C11 = CAP000031922: DB_PART_TYPE: Ceramic_SMD\Standard_C0G; DB_MANUFACTURER_PART: KEMET    C0603C180J5GAC; NOTE: <NOTE>; DB_T_RANGE: -55 to 125; DB_PACKAGE: 0603; DB_DESCRIPTION: C C0G 18pF 5% 50V 0603; DB_CERTIFIED: ISHIDDEN=T; DB_APPROVED_ON: 09.10.2010 г.; DB_STATUS: NEW; DB_PART_NUMBER: CAP000031922; DB_VALUE: 18pF; DB_PCB_DEVICE: SMD_0603_CAPC1608X95N; DB_PRICE: ISHIDDEN=T; DB_LEADTIME: ISHIDDEN=T; DB_MOQ: ISHIDDEN=T; DB_PRICE_DATE: ISHIDDEN=T; DB_APPROVED_BY: ISHIDDEN=T; DB_DATASHEET: http://john.epiqdesign.com/projects/CIS_Datasheets/F3102_CE_Kemet.pdf?rev=92&sc=0
C13 = CAP000047355: DB_PART_TYPE: Ceramic_SMD\Standard_X5R; DB_MANUFACTURER_PART: SAMSUNG    CL32A227MQVNNNE; NOTE: <NOTE>; DB_T_RANGE: -55 to 85; DB_PACKAGE: 1210; DB_DESCRIPTION: C X5R 220uF 20% 6.3V 1210; DB_CERTIFIED: ISHIDDEN=T; DB_APPROVED_BY: VSN; DB_APPROVED_ON: 07.5.2014 г. 11:28:08; DB_STATUS: NEW; DB_PART_NUMBER: CAP000047355; DB_VALUE: 220uF; DB_PCB_DEVICE: SMD_1210_CAPC3225X279N; DB_DATASHEET: http://john.epiqdesign.com/projects/CIS_Datasheets/CAP_CL32A227MQVNNNE.pdf?rev=1401&sc=0
C14 C16 C231 = CAP000043686: DB_PART_TYPE: Ceramic_SMD\Standard_X5R; DB_MANUFACTURER_PART: KEMET    C0805C226M9PAC; NOTE: <NOTE>; DB_T_RANGE: -55 to 85; DB_PACKAGE: 0805; DB_DESCRIPTION: C X5R 22uF 20% 6.3V 0805; DB_CERTIFIED: ISHIDDEN=T; DB_APPROVED_ON: 09.10.2010 г.; DB_STATUS: NEW; DB_PART_NUMBER: CAP000043686; DB_VALUE: 22uF; DB_PCB_DEVICE: SMD_0805_CAPC2012X145N; DB_PRICE: ISHIDDEN=T; DB_LEADTIME: ISHIDDEN=T; DB_MOQ: ISHIDDEN=T; DB_PRICE_DATE: ISHIDDEN=T; DB_APPROVED_BY: ISHIDDEN=T; DB_DATASHEET: http://john.epiqdesign.com/projects/CIS_Datasheets/F3102_CE_Kemet.pdf?rev=92&sc=0
C347 = CAP000043344: DB_PART_TYPE: Ceramic_SMD\Standard_X5R; DB_MANUFACTURER_PART: KEMET    C0603C105M9PAC; NOTE: <NOTE>; DB_T_RANGE: -55 to 85; DB_PACKAGE: 0603; DB_DESCRIPTION: C X5R 1uF 20% 6.3V 0603; DB_CERTIFIED: ISHIDDEN=T; DB_APPROVED_ON: 09.10.2010 г.; DB_STATUS: NEW; DB_PART_NUMBER: CAP000043344; DB_VALUE: 1uF; DB_PCB_DEVICE: SMD_0603_CAPC1608X95N; DB_PRICE: ISHIDDEN=T; DB_LEADTIME: ISHIDDEN=T; DB_MOQ: ISHIDDEN=T; DB_PRICE_DATE: ISHIDDEN=T; DB_APPROVED_BY: ISHIDDEN=T; DB_DATASHEET: http://john.epiqdesign.com/projects/CIS_Datasheets/F3102_CE_Kemet.pdf?rev=92&sc=0
C592 = CAP000043636: DB_PART_TYPE: Ceramic_SMD\Standard_X5R; DB_MANUFACTURER_PART: KEMET    C0805C106K4PAC; NOTE: <NOTE>; DB_T_RANGE: -55 to 85; DB_PACKAGE: 0805; DB_DESCRIPTION: C X5R 10uF 10% 16V 0805; DB_CERTIFIED: ISHIDDEN=T; DB_APPROVED_ON: 09.10.2010 г.; DB_STATUS: NEW; DB_PART_NUMBER: CAP000043636; DB_VALUE: 10uF; DB_PCB_DEVICE: SMD_0805_CAPC2012X145N; DB_PRICE: ISHIDDEN=T; DB_LEADTIME: ISHIDDEN=T; DB_MOQ: ISHIDDEN=T; DB_PRICE_DATE: ISHIDDEN=T; DB_APPROVED_BY: ISHIDDEN=T; DB_DATASHEET: http://john.epiqdesign.com/projects/CIS_Datasheets/F3102_CE_Kemet.pdf?rev=92&sc=0
D1 = OPT000000095: as D5 on sheet CPU_Logic; DB_PCB_DEVICE: SMD_0805_LED2012X100N; DB_PART_NUMBER: OPT000000095; DB_PART_TYPE: LED; DB_COLOUR: RED; DB_DATASHEET: http://john.epiqdesign.com/projects/CIS_Datasheets/LED_KP-2012EC_0805_RED.pdf?rev=1358&sc=0
D2 = OPT000000096: as D7 on sheet CPU_Logic; DB_PCB_DEVICE: SMD_0805_LED2012X100N; DB_PART_NUMBER: OPT000000096; DB_PART_TYPE: LED; DB_COLOUR: GREEN; DB_DATASHEET: http://john.epiqdesign.com/projects/CIS_Datasheets/LED_KP-2012CGCK_0805_GREEN.pdf?rev=1359&sc=0
D3 = OPT000000092: as D9 on sheet CPU_Logic; DB_PCB_DEVICE: SMD_0805_LED2012X100N; DB_PART_NUMBER: OPT000000092; DB_PART_TYPE: LED; DB_COLOUR: YELLOW; DB_DATASHEET: http://john.epiqdesign.com/projects/CIS_Datasheets/LED_17-21-Y2C-A0L1M2V0B-3T-AM.pdf?rev=1220&sc=0
D4 = OPT000000096: as D17 on sheet CPU_Logic; DB_PCB_DEVICE: SMD_0805_LED2012X100N; DB_PART_NUMBER: OPT000000096; DB_DATASHEET: http://john.epiqdesign.com/projects/CIS_Datasheets/LED_KP-2012CGCK_0805_GREEN.pdf?rev=1359&sc=0
D6 = DDE000002846: DB_PART_TYPE: ESD protection; DB_MANUFACTURER_PART: ON SEMICONDUCTOR        SMS05T1G; DB_T_RANGE: -55 to 150; DB_VOLTAGE: 5V; DB_PACKAGE: SC-74; DB_DESCRIPTION: D SMS05T1G SC-74; DB_CERTIFIED: ISHIDDEN=T; DB_APPROVED_BY: VSN; DB_APPROVED_ON: 24.3.2014 г. 10:22:08; DB_STATUS: NEW; DB_PART_NUMBER: DDE000002846; DB_VALUE: SMS05T1G; DB_PCB_DEVICE: SMD_SOT457_SOT95P275X110-6N; DB_DATASHEET: http://john.epiqdesign.com/projects/CIS_Datasheets/IC_SMS05T1-D.pdf?rev=1323&sc=0
D8 = DDE000000580: DB_PART_TYPE: Schottky; DB_MANUFACTURER_PART: Diodes        B140; NOTE: <NOTE>; DB_T_RANGE: -65 to +150; DB_VOLTAGE: 40V; DB_CURRENT: 1A; DB_PACKAGE: SMA; DB_DESCRIPTION: D B140 SMA; DB_CERTIFIED: ISHIDDEN=T; DB_APPROVED_ON: 09.10.2010 г.; DB_STATUS: NEW; DB_PART_NUMBER: DDE000000580; DB_PCB_DEVICE: SMD_DO214AC_SMA; DB_PRICE: ISHIDDEN=T; DB_LEADTIME: ISHIDDEN=T; DB_MOQ: ISHIDDEN=T; DB_PRICE_DATE: ISHIDDEN=T; DB_APPROVED_BY: ISHIDDEN=T; DB_DATASHEET: ISHIDDEN=T
D28 = DDE000001725: DB_PART_TYPE: TVS; DB_MANUFACTURER_PART: Diodes        SMCJ12A; NOTE: <NOTE>; DB_T_RANGE: -55 to 150; DB_VOLTAGE: 12V; DB_CURRENT: 75A(Max); DB_PACKAGE: SMC; DB_DESCRIPTION: D SMCJ12A SMC; DB_CERTIFIED: ISHIDDEN=T; DB_APPROVED_ON: 09.10.2010 г.; DB_STATUS: NEW; DB_PART_NUMBER: DDE000001725; DB_PCB_DEVICE: SMD_DO214AC_SMC; DB_PRICE: ISHIDDEN=T; DB_LEADTIME: ISHIDDEN=T; DB_MOQ: ISHIDDEN=T; DB_PRICE_DATE: ISHIDDEN=T; DB_APPROVED_BY: ISHIDDEN=T; DB_DATASHEET: ISHIDDEN=T
FID1 FID2 = FID000000001: NOTE: <NOTE>; DB_VALUE: FIDUCIAL 100X200; DB_DIAMETER: 100X200; DB_PACKAGE: ISHIDDEN=T; DB_APPROVED_ON: 10.9.2010 г.; DB_STATUS: NEW; DB_PART_NUMBER: FID000000001; DB_PART_TYPE: FIDUCIAL; DB_DESCRIPTION: FIDUCIAL 100x200; DB_PCB_DEVICE: FID100X200; DB_MANUFACTURER_PART: ISHIDDEN=T; DB_CERTIFIED: ISHIDDEN=T; DB_PRICE: ISHIDDEN=T; DB_LEADTIME: ISHIDDEN=T; DB_MOQ: ISHIDDEN=T; DB_PRICE_DATE: ISHIDDEN=T; DB_APPROVED_BY: ISHIDDEN=T; DB_DATASHEET: ISHIDDEN=T
J1 = CON000000006: DB_PART_TYPE: Connector; DB_MANUFACTURER_PART: W+P        143-12-005-00; NOTE: <NOTE>; DB_PINS_NUMBER: ISHIDDEN=T; DB_T_RANGE: -55 to 125; DB_PACKAGE: PTH; DB_DESCRIPTION: CONN PCB 5P M S 143-12-005-00; DB_APPROVED_BY: VSN; DB_APPROVED_ON: 14.12.2010 г. 10:22:07; DB_STATUS: NEW; DB_PART_NUMBER: CON000000006; DB_PITCH: ISHIDDEN=T; DB_VOLTAGE: ISHIDDEN=T; DB_CURRENT: ISHIDDEN=T; DB_IP_CLASS: ISHIDDEN=T; DB_PCB_DEVICE: PTH_HDRV05W64P254_1X05; DB_CERTIFIED: ISHIDDEN=T; DB_PRICE: ISHIDDEN=T; DB_LEADTIME: ISHIDDEN=T; DB_MOQ: ISHIDDEN=T; DB_PRICE_DATE: ISHIDDEN=T; DB_DATASHEET: http://john.epiqdesign.com/projects/CIS_Datasheets/143-12-005-00_W+P.pdf?rev=3&sc=0
J2 = CON000000048: DB_PART_TYPE: Connector; DB_MANUFACTURER_PART: CVILUX       CU04-SCM15B0-R0-LF; NOTE: <NOTE>; DB_PINS_NUMBER: 5; DB_PITCH: 0.8; DB_PACKAGE: SMD; DB_DESCRIPTION: CONN  PCB  5P  F  A  USB5 MINI SMD; DB_CERTIFIED: ISHIDDEN=T; DB_APPROVED_BY: VSN; DB_APPROVED_ON: 02.5.2011 г. 10:29:38; DB_STATUS: NEW; DB_PART_NUMBER: CON000000048; DB_PCB_DEVICE: SMD_CON-CVILUX-CU04-SCM15B0; DB_PRICE: ISHIDDEN=T; DB_LEADTIME: ISHIDDEN=T; DB_MOQ: ISHIDDEN=T; DB_PRICE_DATE: ISHIDDEN=T; DB_DATASHEET: http://john.epiqdesign.com/projects/CIS_Datasheets/USB%20MINI_CVILUX.pdf?rev=249&sc=0
J3 = CON000000272: DB_PART_TYPE: Connector; DB_MANUFACTURER_PART: HOW DER      HD-351-3P; DB_PINS_NUMBER: 3; DB_PITCH: 3.5mm; DB_VOLTAGE: 300VAC; DB_CURRENT: 10A; DB_PACKAGE: PTH; DB_DESCRIPTION: CONN PCB 3P; DB_CERTIFIED: ISHIDDEN=T; DB_APPROVED_BY: VSN; DB_APPROVED_ON: 07.5.2014 г. 14:06:04; DB_STATUS: NEW; DB_PART_NUMBER: CON000000272; DB_PCB_DEVICE: PTH_CON_HD-351-3P; DB_DATASHEET: http://john.epiqdesign.com/projects/CIS_Datasheets/CON_hd-351.pdf?rev=1413&sc=0
J4 = CON000000298: DB_PART_TYPE: Connector; DB_MANUFACTURER_PART: CVILUX        CH81042V200; DB_PINS_NUMBER: 4; DB_PITCH: 2.54mm; DB_PACKAGE: PTH; DB_DESCRIPTION: CONN PCB 4P M S PTH; DB_APPROVED_BY: VSN; DB_STATUS: NEW; DB_PART_NUMBER: CON000000298; DB_PCB_DEVICE: PTH_HDRV40W6240P254_2X02_M; DB_APPROVED_ON: 31.05.2014 15:42:44; DB_DATASHEET: http://john.epiqdesign.com/projects/CIS_Datasheets/CON_CH81XX2H200.pdf?rev=1328&sc=0
J5 = CON000000271: DB_PART_TYPE: Connector; DB_MANUFACTURER_PART: WE         649 006 295 22; DB_PINS_NUMBER: 6; DB_PITCH: 4.2mm; DB_T_RANGE: -40 to 105; DB_VOLTAGE: 600VAC; DB_CURRENT: 6 - 9A; DB_PACKAGE: PTH; DB_DESCRIPTION: CONN PCB 6P M A PTH; DB_CERTIFIED: ISHIDDEN=T; DB_APPROVED_BY: VSN; DB_APPROVED_ON: 07.5.2014 г. 13:56:56; DB_STATUS: NEW; DB_PART_NUMBER: CON000000271; DB_PCB_DEVICE: PTH_CON_WR-MRC4-6P; DB_DATASHEET: http://john.epiqdesign.com/projects/CIS_Datasheets/CON_WR-MPC4.pdf?rev=1412&sc=0
J6 = CON000000026: DB_PART_TYPE: Connector; DB_MANUFACTURER_PART: HONBO       DC-210-112; DB_PINS_NUMBER: 3; DB_PACKAGE: PTH; DB_DESCRIPTION: CONN  PCB  3P  M A  DC-210-112; DB_APPROVED_BY: VSN; DB_STATUS: NEW; DB_PART_NUMBER: CON000000026; DB_PCB_DEVICE: PTH_DC-POWER-JACK_210-112; DB_APPROVED_ON: 22.03.2011 12:51:58; DB_DATASHEET: http://john.epiqdesign.com/projects/CIS_Datasheets/DC210-112_HONBO.pdf?rev=152&sc=0
J9 J13-J15 J22-J24 = MTH000000030: DB_PART_TYPE: Mounting Hole; NOTE: <NOTE>; DB_DIAMETER: 4mm; DB_PLATED: Yes; DB_DESCRIPTION: Mounting Hole PTH_MTG400_700; DB_CERTIFIED: ISHIDDEN=T; DB_APPROVED_BY: VSN; DB_APPROVED_ON: 02.4.2013 г. 15:54:43; DB_STATUS: NEW; DB_PART_NUMBER: MTH000000030; DB_VALUE: PTH_MTG400_700; DB_PCB_DEVICE: PTH_MTG400_700; DB_PRICE: ISHIDDEN=T; DB_LEADTIME: ISHIDDEN=T; DB_MOQ: ISHIDDEN=T; DB_PRICE_DATE: ISHIDDEN=T
R6 R9 R26 R28 R31 R32 = RES000008663: DB_PART_TYPE: SMD; DB_MANUFACTURER_PART: YAGEO    RC0603FR-0710KL; NOTE: <NOTE>; DB_T_RANGE: -55 to 155; DB_POWER: 1/10W; DB_PACKAGE: 0603; DB_DESCRIPTION: R SMD 10k 1% 1/10W 0603; DB_CERTIFIED: ISHIDDEN=T; DB_APPROVED_BY: VSN; DB_APPROVED_ON: 08.8.2011 г. 08:31:51; DB_STATUS: NEW; R_BDS: R; DB_PART_NUMBER: RES000008663; DB_VALUE: 10k; DB_PCB_DEVICE: SMD_0603_RESC1608X55N; DB_PRICE: ISHIDDEN=T; DB_LEADTIME: ISHIDDEN=T; DB_MOQ: ISHIDDEN=T; DB_PRICE_DATE: ISHIDDEN=T; DB_DATASHEET: http://john.epiqdesign.com/projects/CIS_Datasheets/PYu-RC0603_51_RoHS_L_4_YAGEO.pdf?rev=138&sc=0
R13 = RES000006922: DB_PART_TYPE: SMD; DB_MANUFACTURER_PART: YAGEO    RC1206FR-07100R; NOTE: <NOTE>; DB_T_RANGE: -55 to 155; DB_POWER: 1/4W; DB_PACKAGE: 1206; DB_DESCRIPTION: R SMD 100R 1% 1/4W 1206; DB_CERTIFIED: ISHIDDEN=T; DB_APPROVED_ON: 09.10.2010 г.; DB_STATUS: NEW; R_BDS: R; DB_PART_NUMBER: RES000006922; DB_VALUE: 100R; DB_PCB_DEVICE: SMD_1206_RESC3216X65N; DB_PRICE: ISHIDDEN=T; DB_LEADTIME: ISHIDDEN=T; DB_MOQ: ISHIDDEN=T; DB_PRICE_DATE: ISHIDDEN=T; DB_APPROVED_BY: ISHIDDEN=T; DB_DATASHEET: http://john.epiqdesign.com/projects/CIS_Datasheets/PYu-RC1206_51_RoHS_L_4_YAGEO.pdf?rev=138&sc=0
R14 = RES000008756: DB_PART_TYPE: SMD; DB_MANUFACTURER_PART: YAGEO    AC1206FR-070RL; NOTE: <NOTE>; DB_T_RANGE: -55 to 155; DB_POWER: 1/4W; DB_PACKAGE: 1206; DB_DESCRIPTION: R SMD 0R 1% 1/4W 1206; DB_CERTIFIED: AUT; DB_PRICE: ISHIDDEN=T; DB_APPROVED_BY: VSN; DB_APPROVED_ON: 27.4.2012 г. 12:25:00; DB_STATUS: NEW; R_BDS: R; DB_PART_NUMBER: RES000008756; DB_VALUE: 0R; DB_PCB_DEVICE: SMD_1206_RESC3216X65N; DB_LEADTIME: ISHIDDEN=T; DB_MOQ: ISHIDDEN=T; DB_PRICE_DATE: ISHIDDEN=T; DB_DATASHEET: http://john.epiqdesign.com/projects/CIS_Datasheets/RES_AC_YAGEO.pdf?rev=263&sc=0
R16 = R_42k: DB_PART_NUMBER: RES000001590; DB_PART_TYPE: SMD; DB_MANUFACTURER_PART: YAGEO    RC0603FR-0741K2; NOTE: <NOTE>; R_BDS: R; DB_T_RANGE: -55 to 155; DB_POWER: 1/10W; DB_PACKAGE: 0603; DB_DESCRIPTION: R SMD 41K2 1% 1/10W 0603; DB_CERTIFIED: ISHIDDEN=T; DB_PRICE: 0.00063; DB_MOQ: 5000; DB_APPROVED_ON: 09.10.2010 г.; DB_STATUS: NEW; DB_PCB_DEVICE: SMD_0603_RESC1608X55N; DB_PRICE_DATE: 2010-12-23; DB_APPROVED_BY: ISHIDDEN=T; DB_DATASHEET: http://john.epiqdesign.com/projects/CIS_Datasheets/PYu-RC0603_51_RoHS_L_4_YAGEO.pdf?rev=138&sc=0
R17 = RES000006287: DB_PART_TYPE: SMD; DB_MANUFACTURER_PART: YAGEO    RC0603FR-0730K; NOTE: <NOTE>; DB_T_RANGE: -55 to 155; DB_POWER: 1/10W; DB_PACKAGE: 0603; DB_DESCRIPTION: R SMD 30K 1% 1/10W 0603; DB_CERTIFIED: ISHIDDEN=T; DB_PRICE: 0.00063; DB_MOQ: 5000; DB_APPROVED_ON: 09.10.2010 г.; DB_STATUS: NEW; R_BDS: R; DB_PART_NUMBER: RES000006287; DB_VALUE: 30k; DB_PCB_DEVICE: SMD_0603_RESC1608X55N; DB_PRICE_DATE: 2010-12-23; DB_APPROVED_BY: ISHIDDEN=T; DB_DATASHEET: http://john.epiqdesign.com/projects/CIS_Datasheets/PYu-RC0603_51_RoHS_L_4_YAGEO.pdf?rev=138&sc=0
R27 = RES000008586: DB_PART_TYPE: SMD; DB_MANUFACTURER_PART: YAGEO       AC0603FR-072KL; NOTE: <NOTE>; DB_T_RANGE: -55 to 155; DB_POWER: 1/10W; DB_PACKAGE: 0603; DB_DESCRIPTION: R SMD 2k 1% 1/10W 0603; DB_CERTIFIED: AUT; DB_PRICE: ISHIDDEN=T; DB_APPROVED_BY: VSN; DB_APPROVED_ON: 03.5.2011 г. 11:15:27; DB_STATUS: NEW; R_BDS: R; DB_PART_NUMBER: RES000008586; DB_VALUE: 2k; DB_PCB_DEVICE: SMD_0603_RESC1608X55N; DB_LEADTIME: ISHIDDEN=T; DB_MOQ: ISHIDDEN=T; DB_PRICE_DATE: ISHIDDEN=T; DB_DATASHEET: http://john.epiqdesign.com/projects/CIS_Datasheets/RES_AC_YAGEO.pdf?rev=263&sc=0
R33 = RES000008926: DB_PART_TYPE: SMD; DB_MANUFACTURER_PART: YAGEO    AC0603FR-070RL; NOTE: <NOTE>; DB_T_RANGE: -55 to 155; DB_POWER: 1/10W; DB_PACKAGE: 0603; DB_DESCRIPTION: R SMD 0R 1% 1/10W 0603; DB_CERTIFIED: AUT; DB_APPROVED_BY: VSN; DB_APPROVED_ON: 21.5.2013 г. 09:19:53; DB_STATUS: NEW; R_BDS: R; DB_PART_NUMBER: RES000008926; DB_VALUE: 0R; DB_PCB_DEVICE: SMD_0603_RESC1608X55N; DB_DATASHEET: http://john.epiqdesign.com/projects/CIS_Datasheets/RES_AC_YAGEO.pdf?rev=263&sc=0
R34 = RES000007051: DB_PART_TYPE: SMD; DB_MANUFACTURER_PART: YAGEO    RC1206JR-072R; NOTE: <NOTE>; DB_T_RANGE: -55 to 155; DB_POWER: 1/4W; DB_PACKAGE: 1206; DB_DESCRIPTION: R SMD 2R 5% 1/4W 1206; DB_CERTIFIED: ISHIDDEN=T; DB_APPROVED_ON: 09.10.2010 г.; DB_STATUS: NEW; R_BDS: R; DB_PART_NUMBER: RES000007051; DB_VALUE: 2R; DB_PCB_DEVICE: SMD_1206_RESC3216X65N; DB_PRICE: ISHIDDEN=T; DB_LEADTIME: ISHIDDEN=T; DB_MOQ: ISHIDDEN=T; DB_PRICE_DATE: ISHIDDEN=T; DB_APPROVED_BY: ISHIDDEN=T; DB_DATASHEET: http://john.epiqdesign.com/projects/CIS_Datasheets/PYu-RC1206_51_RoHS_L_4_YAGEO.pdf?rev=138&sc=0
TP2 TP3 TP5-TP7 TP10-TP14 TP17-TP23 TP25 TP26 TP28 TP29 TP123-TP129 TP131 TP132 = TPO000000001: as TP1 on sheet CPU_Logic; DB_PART_NUMBER: TPO000000001; DB_DIAMETER: 100_254; DB_PCB_DEVICE: SMD_TP_100-254; DB_MANUFACTURER_PART: ISHIDDEN=T; DB_CERTIFIED: ISHIDDEN=T; DB_PRICE: ISHIDDEN=T; DB_LEADTIME: ISHIDDEN=T; DB_MOQ: ISHIDDEN=T; DB_PRICE_DATE: ISHIDDEN=T; DB_APPROVED_BY: ISHIDDEN=T; DB_DATASHEET: ISHIDDEN=T
U6 = PSU000000127: DB_PART_TYPE: Linear Voltage Regulator; DB_MANUFACTURER_PART: ROHM        BD33KA5WF-E2; DB_T_RANGE: -40 to 105; DB_VOLTAGE: 3.3V; DB_CURRENT: 500mA; DB_PACKAGE: SOIC-8; DB_DESCRIPTION: IC BD33KA5WF-E2 SOIC-8; DB_CERTIFIED: ISHIDDEN=T; DB_APPROVED_BY: VSN; DB_APPROVED_ON: 07.5.2014 г. 13:18:28; DB_STATUS: NEW; DB_PART_NUMBER: PSU000000127; DB_PCB_DEVICE: SMD_SOIC127P620X160-8N; DB_DATASHEET: http://john.epiqdesign.com/projects/CIS_Datasheets/IC_bdxxka5wf-e-209388.pdf?rev=1408&sc=0
U7 = PSU000000129: DB_PART_TYPE: Linear Voltage Regulator; DB_MANUFACTURER_PART: ST       L7805CD2T-TR; NOTE: <NOTE>; DB_T_RANGE: 0 to 125; DB_VOLTAGE: 5V; DB_CURRENT: 1A; DB_PACKAGE: D2PAK; DB_DESCRIPTION: IC  L7805CD2T-TR  D2PAK; DB_CERTIFIED: ISHIDDEN=T; DB_APPROVED_BY: VSN; DB_APPROVED_ON: 07.5.2014 г. 13:29:21; DB_STATUS: NEW; DB_PART_NUMBER: PSU000000129; DB_VALUE: L7805CD2T-TR; DB_PCB_DEVICE: SMD_TO254P1542X460-3_4N; DB_DATASHEET: http://john.epiqdesign.com/projects/CIS_Datasheets/IC_L7805C.pdf?rev=1409&sc=0
U9 U29 = PSU000000128: DB_PART_TYPE: Linear Voltage Regulator; DB_MANUFACTURER_PART: ROHM        BD00KA5WF-E2; DB_T_RANGE: -40 to 105; DB_VOLTAGE: 3.3V; DB_CURRENT: 500mA; DB_PACKAGE: SOIC-8; DB_DESCRIPTION: IC BD00KA5WF-E2 SOIC-8; DB_CERTIFIED: ISHIDDEN=T; DB_APPROVED_BY: VSN; DB_APPROVED_ON: 07.5.2014 г. 13:19:57; DB_STATUS: NEW; DB_PART_NUMBER: PSU000000128; DB_PCB_DEVICE: SMD_SOIC127P620X160-8N; DB_DATASHEET: http://john.epiqdesign.com/projects/CIS_Datasheets/IC_bdxxka5wf-e-209388.pdf?rev=1408&sc=0
U10 = MCU000000070: DB_PART_TYPE: DSP; DB_MANUFACTURER_PART: MICROCHIP        DSPIC33EP256MU806-E/PT; OriginalSymbolOrigin: (30000,20000); < Value >: Type; DeviceNumbering: Alpha; DeviceDesignator: A; DevicesInPackage: 1; IsHeterogeneous: False; DB_T_RANGE: -40 to 125; DB_PACKAGE: TQFP-64; DB_DESCRIPTION: IC dsPIC33EP256MU806 TQFP-64; DB_CERTIFIED: AUT; DB_PRICE: ISHIDDEN=T; DB_APPROVED_BY: VSN; DB_APPROVED_ON: 17.7.2012 г. 14:21:28; DB_STATUS: NEW; Package: <Package>; DevicesInView: 1; PackageName: PIC24FJ16GA004_X_PT; DB_PART_NUMBER: MCU000000070; DB_PCB_DEVICE: SMD_QFP50P1200X1200X120-64N; DB_LEADTIME: ISHIDDEN=T; DB_MOQ: ISHIDDEN=T; DB_PRICE_DATE: ISHIDDEN=T; DB_DATASHEET: http://john.epiqdesign.com/projects/CIS_Datasheets/dsPIC33EPxxx-Microchip.pdf?rev=798&sc=0
Y1 = OSC000000012: DB_PART_TYPE: Oscillator; DB_MANUFACTURER_PART: IQD       4.00MHz HC49/4HSMX; NOTE: <NOTE>; DB_ACCURACY: 100ppm; DB_T_RANGE: -10 to 60; DB_FREQUENCY: 4MHz; DB_PACKAGE: SMD; DB_DESCRIPTION: IC  4.00MHz HC49/4HSMX  SMD; DB_CERTIFIED: ISHIDDEN=T; DB_APPROVED_BY: VSN; DB_APPROVED_ON: 26.4.2012 г. 15:32:29; DB_STATUS: NEW; DB_PART_NUMBER: OSC000000012; DB_PCB_DEVICE: SMD_HC49_XTAL1140X480X420N; DB_PRICE: ISHIDDEN=T; DB_LEADTIME: ISHIDDEN=T; DB_MOQ: ISHIDDEN=T; DB_PRICE_DATE: ISHIDDEN=T; DB_DATASHEET: http://john.epiqdesign.com/projects/CIS_Datasheets/hc49-4hsmx_IQD_oscillators.pdf?rev=713&sc=0